# EAGLE schematic ChargerShieldExp (EAGLE 6.5.0)
Dings

## Sheet 1 of 2: User Interface
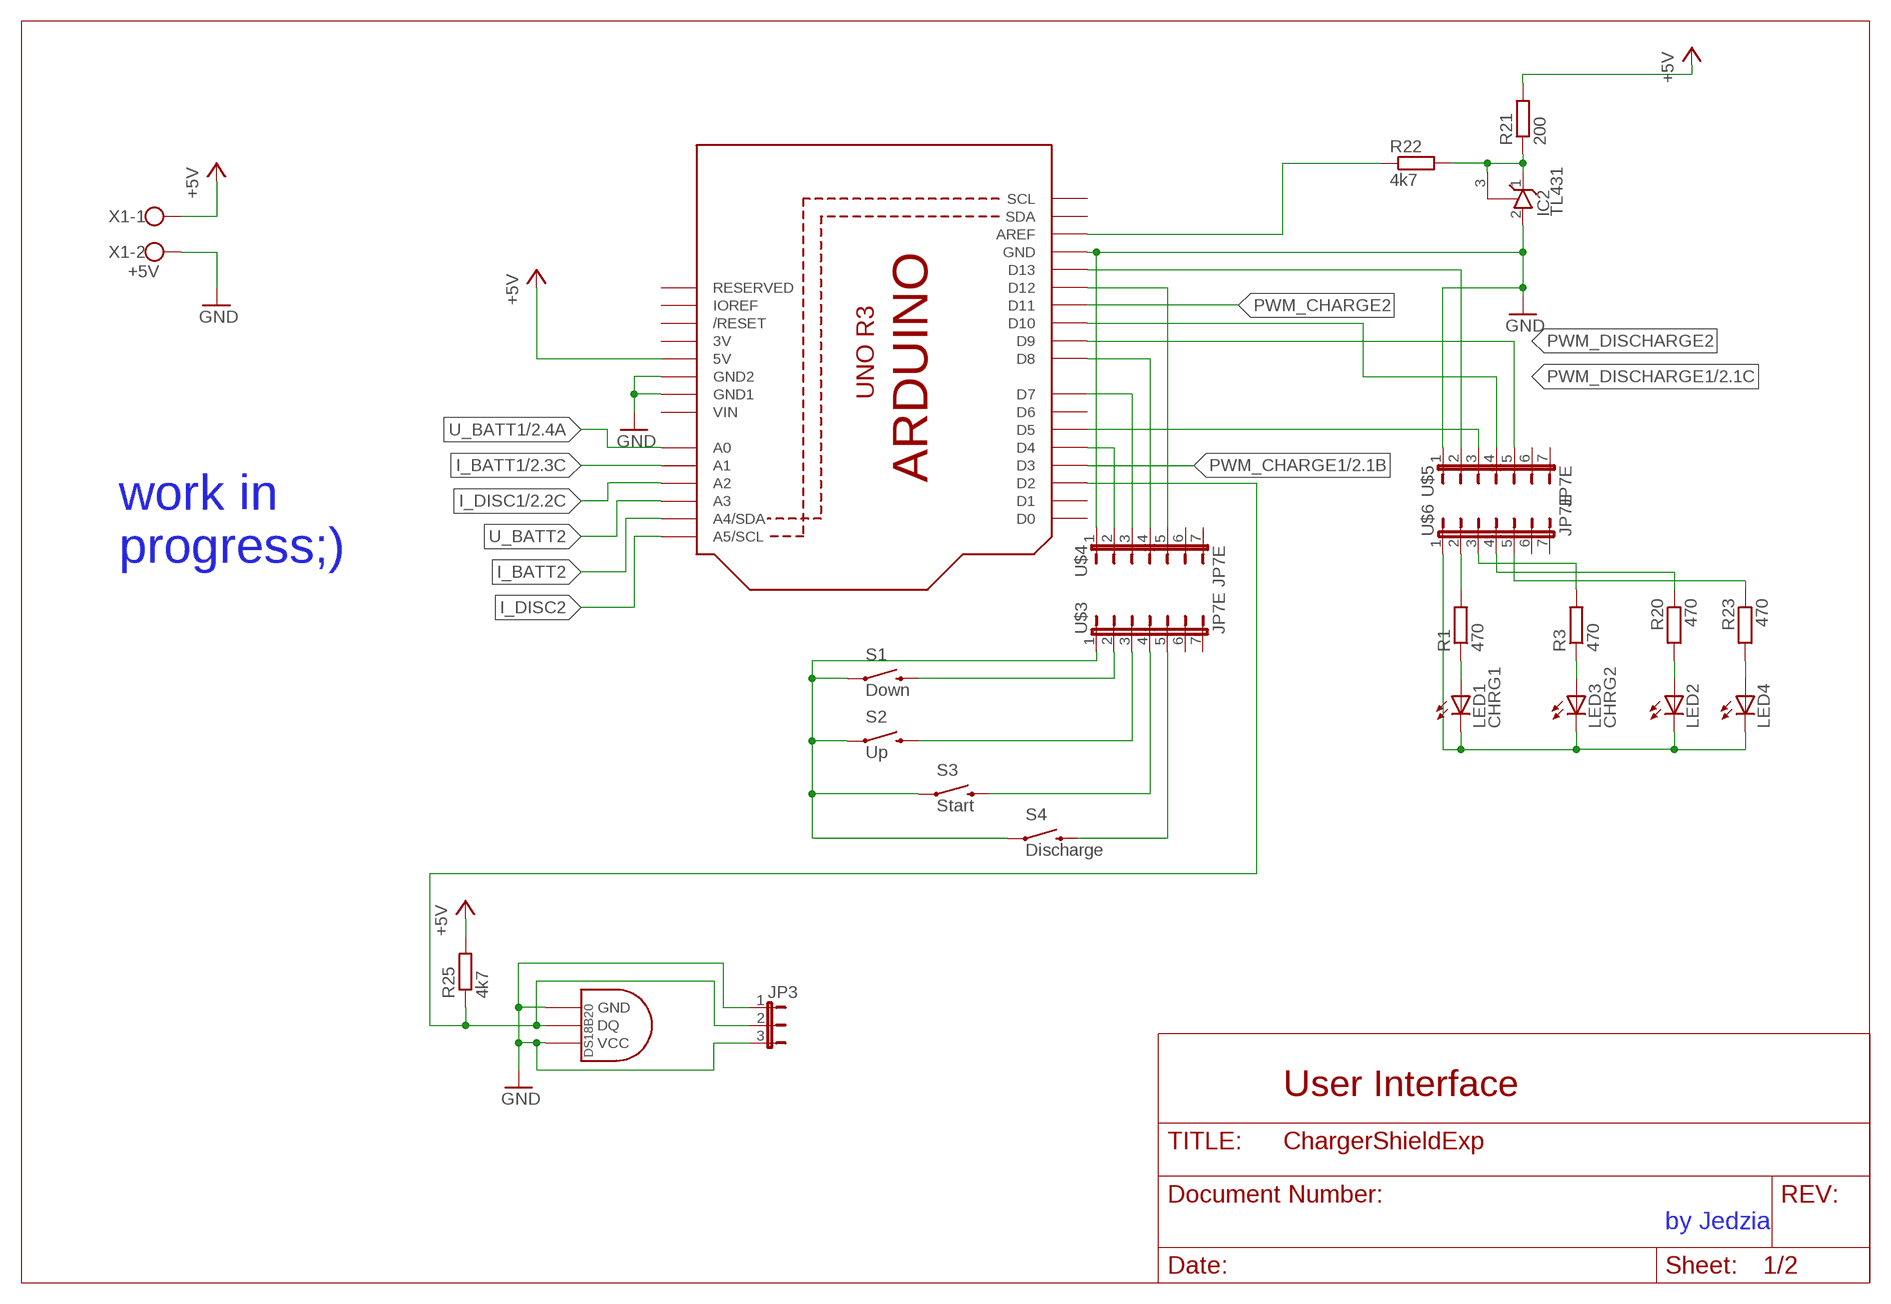
[diagram p0: schematic, sheet 1]

### Parts
IC2  TL431  TL431TO92  [TO92]
JP3  JP2E  [JP2]
LED1  CHRG1  LED5MM_BIG  [LED5MM_BIG]
LED2  LED5MM_BIG  [LED5MM_BIG]
LED3  CHRG2  LED5MM_BIG  [LED5MM_BIG]
LED4  LED5MM_BIG  [LED5MM_BIG]
R1  470  R-EU_0207/12  [0207/12]
R3  470  R-EU_0207/10  [0207/10]
R20  470  R-EU_0207/10  [0207/10]
R21  200  R-EU_0204/7  [0204/7]
R22  4k7  R-EU_0207/10  [0207/10]
R23  470  R-EU_0207/10  [0207/10]
R25  4k7  R-EU_0204/7  [0204/7]
S1  Down  SWITCH-MOMENTARY-2PTH  [TACTILE-PTH]
S2  Up  SWITCH-MOMENTARY-2PTH  [TACTILE-PTH]
S3  Start  SWITCH-MOMENTARY-2PTH  [TACTILE-PTH]
S4  Discharge  SWITCH-MOMENTARY-2PTH  [TACTILE-PTH]
U$1  ARDUINOR3BPLACE-LONG  [ARDUINOR3-BPLACE-LONG]
U$2  DS1820TO92  [DS1820]
U$3  JP7E  [JP7]
U$4  JP7E  [JP7]
U$5  JP7E  [JP7]
U$6  JP7E  [JP7]
X1  +5V  W237-102  [W237-102]

### Nets
+5V: R21.2 R25.2 U$1.5V X1.1 ; also sheet 2
GND: IC2.2(A) JP3.1 JP3.3 U$1.GND U$1.GND1 U$1.GND2 U$2.GND U$2.VDD(VCC) U$4.1 U$5.1 X1.2 ; also sheet 2
GND2: LED1.K(C) LED2.K(C) LED3.K(C) LED4.K(C) S1.1 S2.1 S3.1 S4.1 U$3.1 U$6.1
I_BATT1: U$1.A1 ; also sheet 2
I_BATT2: U$1.A4(A4/SDA)
I_DISC1: U$1.A2 ; also sheet 2
I_DISC2: U$1.A5(A5/SCL)
N$1: U$1.D13 U$5.2
N$2: LED1.A R1.1
N$3: S1.3 U$3.2
N$4: S2.3 U$3.3
N$12: JP3.2 R25.1 U$1.D2 U$2.DQ
N$19: U$1.D5 U$5.3
N$20: LED2.A R20.2
N$21: LED4.A R23.2
N$22: S3.3 U$3.4
N$23: U$1.D12 U$4.5
N$24: LED3.A R3.1
N$26: U$1.D4 U$4.2
N$27: IC2.1(C) IC2.3(R) R21.1 R22.2
N$28: R22.1 U$1.AREF
N$30: U$1.D7 U$4.3
N$31: U$1.D8 U$4.4
N$32: S4.3 U$3.5
N$33: R3.2 U$6.3
N$34: R1.2 U$6.2
N$35: R20.1 U$6.4
N$36: R23.1 U$6.5
PWM_CHARGE1: U$1.D3 ; also sheet 2
PWM_CHARGE2: U$1.D11
PWM_DISCHARGE1: U$1.D10 U$5.4 ; also sheet 2
PWM_DISCHARGE2: U$1.D9 U$5.5
U_BATT1: U$1.A0 ; also sheet 2
U_BATT2: U$1.A3
Unconnected: U$1.D0 U$1.D1 U$1.D6 U$1.IOREF U$1.RESERVED U$1.RESET(/RESET) U$1.SCL U$1.SDA U$3.6 U$3.7 U$4.6 U$4.7 U$5.6 U$5.7 U$6.6 U$6.7

### Notes on the sheet
- work in
  progress;)
- User Interface
- by Jedzia

## Sheet 2 of 2
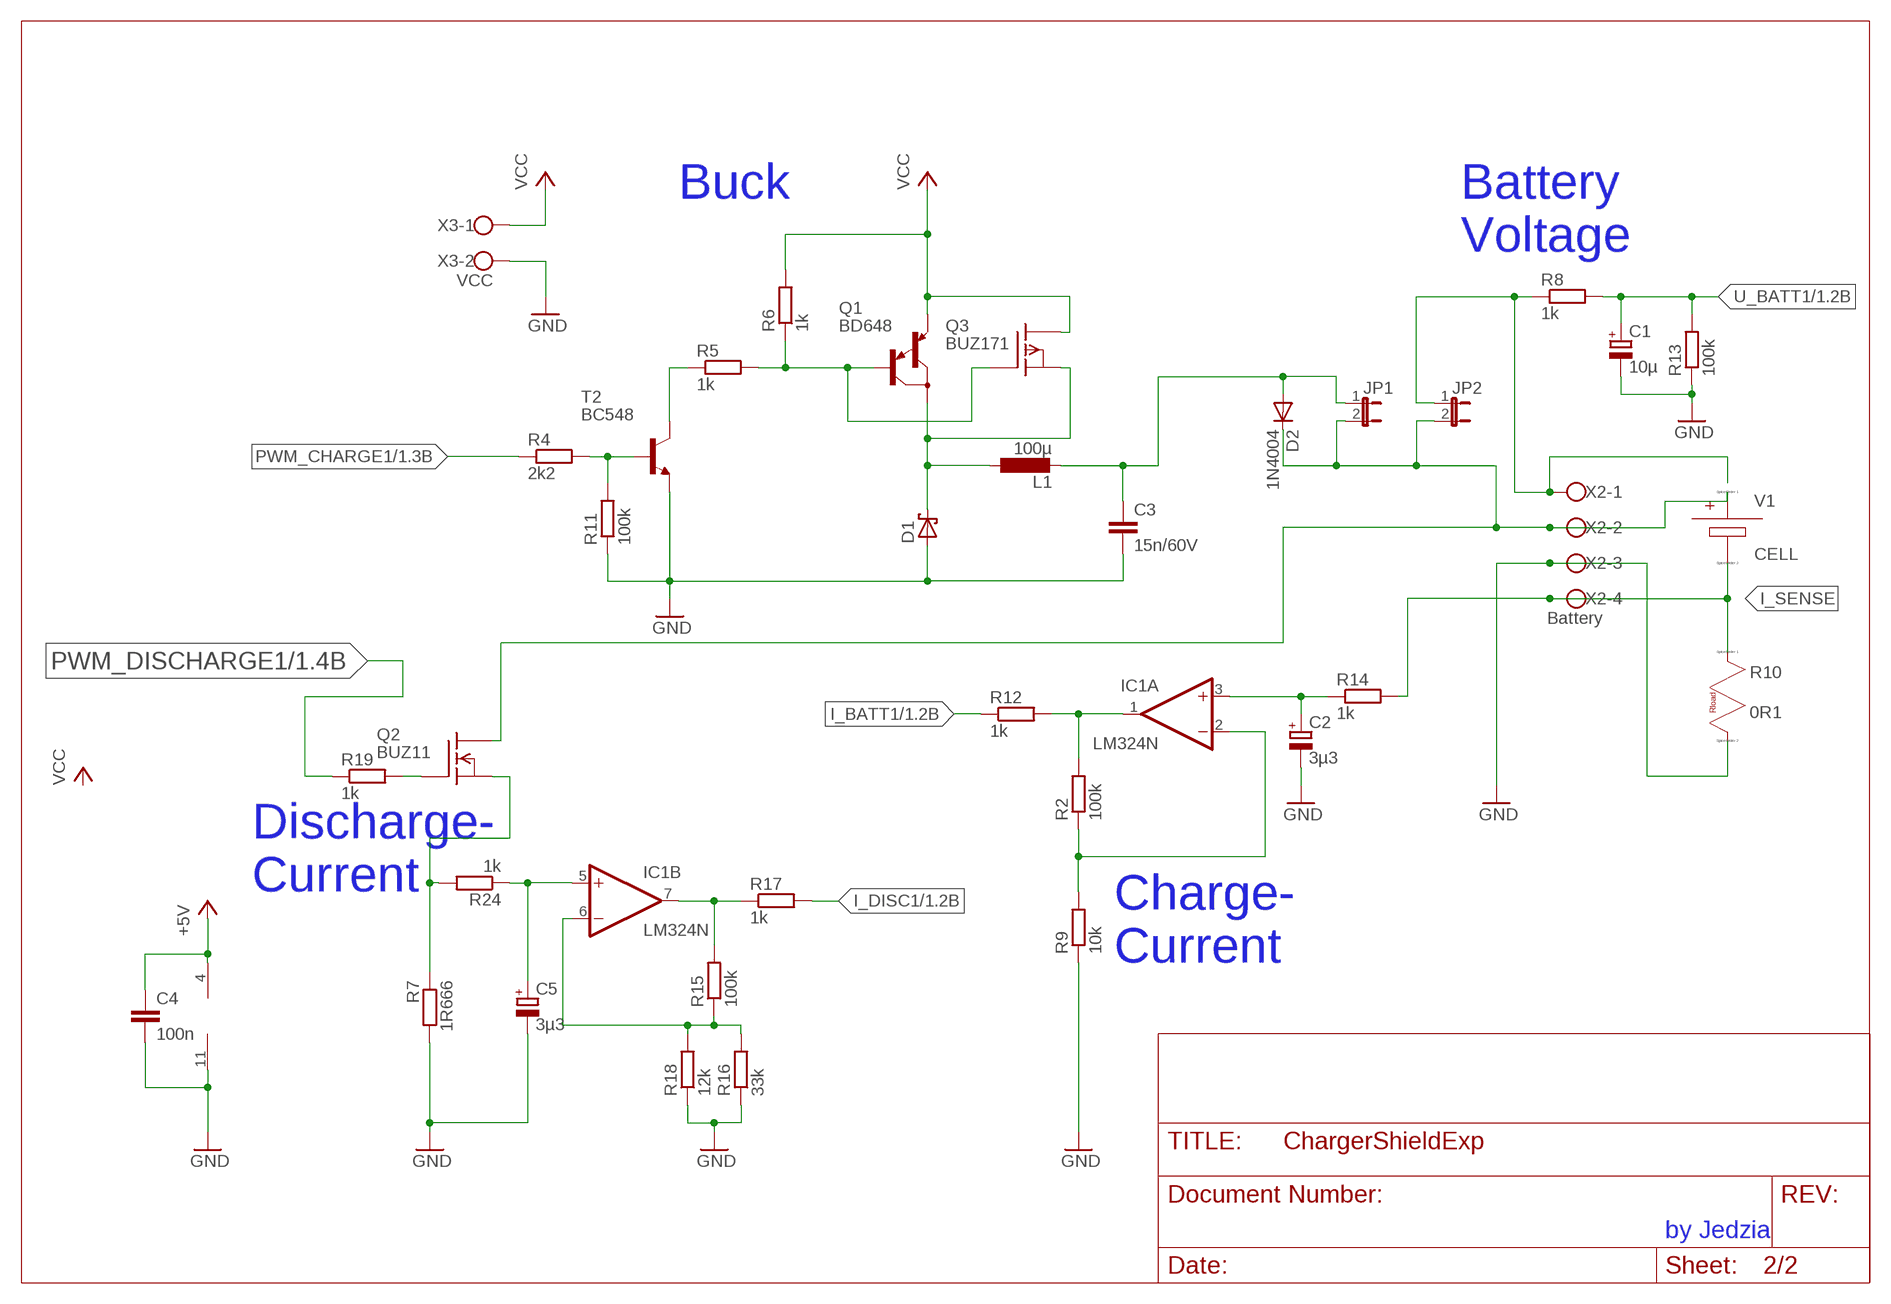
[diagram p1: schematic, sheet 2]

### Parts
C1  10µ  CPOL-EUE5-5  [E5-5]
C2  3µ3  CPOL-EUE5-5  [E5-5]
C3  15n/60V  C-EU025_050-025X075  [C025_050-025X075]
C4  100n  C-EU025_050-025X075  [C025_050-025X075]
C5  3µ3  CPOL-EUE5-5  [E5-5]
D1  SCHOTTKY-DIODEDO35-7  [DO35-7]
D2  1N4004  [DO41-10]
IC1  LM324N  [DIL14]
JP1  JP1E  [JP1]
JP2  JP1E  [JP1]
L1  100µ  L-EU0207/12  [0207/12]
Q1  BD648  [TO220]
Q2  BUZ11  [TO220]
Q3  BUZ171  [TO220]
R2  100k  R-EU_0204/7  [0204/7]
R4  2k2  R-EU_0207/10  [0207/10]
R5  1k  R-EU_0207/10  [0207/10]
R6  1k  R-EU_0207/10  [0207/10]
R7  1R666  R-EU_0414/15  [0414/15]
R8  1k  R-EU_0207/12  [0207/12]
R9  10k  R-EU_0204/7  [0204/7]
R10  0R1  RES_RLOAD  (no package)
R11  100k  R-EU_0207/10  [0207/10]
R12  1k  R-EU_0207/12  [0207/12]
R13  100k  R-EU_0207/10  [0207/10]
R14  1k  R-EU_0207/10  [0207/10]
R15  100k  R-EU_0207/10  [0207/10]
R16  33k  R-EU_0207/10  [0207/10]
R17  1k  R-EU_0207/15  [0207/15]
R18  12k  R-EU_0207/10  [0207/10]
R19  1k  R-EU_0207/12  [0207/12]
R24  1k  R-EU_0207/10  [0207/10]
T2  BC548  BC238  [TO92]
V1  CELL  (no package)
X2  Battery  W237-4  [W237-4]
X3  VCC  W237-102  [W237-102]

### Nets
+5V: C4.1 IC1.4(P:V+) ; also sheet 1
GND: C1.- C2.- C3.2 C4.2 C5.- D1.A IC1.11(P:V-) R7.2 R9.1 R10.B R11.1 R13.1 R16.1 R18.1 T2.1(E) X2.3 X3.2 ; also sheet 1
I_BATT1: R12.1 ; also sheet 1
I_DISC1: R17.2 ; also sheet 1
I_SENSE: R10.A R14.2 V1.- X2.4
N$5: R4.2 R11.2 T2.2(B)
N$6: R5.1 T2.3(C)
N$7: Q1.1(B) Q3.1(G) R5.2 R6.1
N$8: JP2.1 R8.1 X2.1
N$9: D1.C L1.1 Q1.2(C) Q3.3(S)
N$10: C3.1 D2.A JP1.1 L1.2
N$11: IC1.1(A:OUT) R2.2 R12.2
N$13: D2.C JP1.2 JP2.2 Q2.2(D) V1.+ X2.2
N$14: IC1.2(A:-IN) R2.1 R9.2
N$15: C2.+ IC1.3(A:+IN) R14.1
N$16: IC1.6(B:-IN) R15.1 R16.2 R18.2
N$17: IC1.7(B:OUT) R15.2 R17.1
N$18: Q2.1(G) R19.2
N$25: Q2.3(S) R7.1 R24.2
N$29: C5.+ IC1.5(B:+IN) R24.1
PWM_CHARGE1: R4.1 ; also sheet 1
PWM_DISCHARGE1: R19.1 ; also sheet 1
U_BATT1: C1.+ R8.2 R13.2 ; also sheet 1
VCC: Q1.3(E) Q3.2(D) R6.2 X3.1
Unconnected: IC1.8(C:OUT) IC1.9(C:-IN) IC1.10(C:+IN) IC1.12(D:+IN) IC1.13(D:-IN) IC1.14(D:OUT)

### Notes on the sheet
- Buck
- Battery
  Voltage
- Discharge-
  Current
- Charge-
  Current
- by Jedzia

## Power pins joined to a net without a drawn wire
3V: U$1.3V
VIN: U$1.VIN

## Library data of the parts
C1 C2 C5 = rcl:CPOL-EU: POLARIZED CAPACITOR, European symbol
C3 C4 = rcl:C-EU: CAPACITOR, European symbol
D1 = diode:SCHOTTKY-DIODE: Schottky Diode
D2 = diode:1N4004: DIODE general purpose rectifier, 1 A
IC1 = linear:LM324: OP AMP
IC2 = AWJLEagleLib:TL431: TL431 shunt regulator CARE: not a standard pinout. This part has 1: cathode, 2: REF, 3: anode
JP1 JP2 = bigger:JP1E: JUMPER
JP3 = bigger:JP2E: JUMPER
L1 = rcl:L-EU: INDUCTOR, European symbol
LED1-LED4 = bigger:LED: LED OSRAM: - CHIPLED LG R971, LG N971, LY N971, LG Q971, LY Q971, LO R971, LY R971 LH N974, LH R974 LS Q976, LO Q976, LY Q976 LO Q996 - Hyper CHIPLED LW Q18S LB Q993, LB Q99A, LB R99A - SideLED LS A670, LO A670, LY A670, LG A670, LP A670 LB A673, LV A673, LT A673, LW A673 LH A674 LY A675 LS A676, LA A676, LO A676, LY A676, LW A676 LS A679, LY A679, LG A679 - Hyper Micro SIDELED® LS Y876, LA Y876, LO Y876, LY Y876 LT Y87S - SmartLED LW L88C, LW L88S LB L89C, LB L89S, LG L890 LS L89K, LO L89K, LY L89K LS L896, LA L896, LO L896, LY L896 - TOPLED LS T670, LO T670, LY T670, LG T670, LP T670 LSG T670, LSP T670, LSY T670, LOP T670, LYG T670 LG T671, LOG T671, LSG T671 LB T673, LV T673, LT T673, LW T673 LH T674 LS T676, LA T676, LO T676, LY T676, LB T676, LH T676, LSB T676, LW T676 LB T67C, LV T67C, LT T67C, LS T67K, LO T67K, LY T67K, LW E67C LS E67B, LA E67B, LO E67B, LY E67B, LB E67C, LV E67C, LT E67C LW T67C LS T679, LY T679, LG T679 LS T770, LO T770, LY T770, LG T770, LP T770 LB T773, LV T773, LT T773, LW T773 LH T774 LS E675, LA E675, LY E675, LS T675 LS T776, LA T776, LO T776, LY T776, LB T776 LHGB T686 LT T68C, LB T68C - Hyper Mini TOPLED® LB M676 - Mini TOPLED Santana® LG M470 LS M47K, LO M47K, LY M47K Source: http://www.osram.convergy.de LUXEON: - LUMILED® LXK2-PW12-R00, LXK2-PW12-S00, LXK2-PW14-U00, LXK2-PW14-V00 LXK2-PM12-R00, LXK2-PM12-S00, LXK2-PM14-U00 LXK2-PE12-Q00, LXK2-PE12-R00, LXK2-PE12-S00, LXK2-PE14-T00, LXK2-PE14-U00 LXK2-PB12-K00, LXK2-PB12-L00, LXK2-PB12-M00, LXK2-PB14-N00, LXK2-PB14-P00, LXK2-PB14-Q00 LXK2-PR12-L00, LXK2-PR12-M00, LXK2-PR14-Q00, LXK2-PR14-R00 LXK2-PD12-Q00, LXK2-PD12-R00, LXK2-PD12-S00 LXK2-PH12-R00, LXK2-PH12-S00 LXK2-PL12-P00, LXK2-PL12-Q00, LXK2-PL12-R00 Source: www.luxeon.com KINGBRIGHT: KA-3528ASYC Source: www.kingbright.com
Q1 = transistor-pnp:BD648: PNP Darlington Transistor
Q2 = transistor-fet:BUZ11: N-Channel Enhancement MOSFET 50V; 30A; 0,040Ohm
Q3 = transistor-fet:BUZ171: P-Channel Enhancement MOSFET -50V; 7A; 0,4Ohm
R1-R9 R11-R25 = rcl:R-EU_: RESISTOR, European symbol
R10 = lt-spice-simulation:RES_RLOAD: A resistor
S1-S4 = SparkFun-Electromechanical:SWITCH-MOMENTARY-2: Various NO switches- pushbuttons, reed, etc
T2 = transistor:BC238: NPN TRANSISTOR
U$1 = arduino-long:ARDUINOR3: This is a new object for the new Arduino R3 - with extra pins that you may want to use (such as IOref, and duplicated A4/A5
U$2 = Ava:DS1820: DS18B20 Programmable Resolution 1-Wire Digital Thermometer Description The DS18B20 digital thermometer provides 9-bit to 12-bit Celsius temperature measurements and has an alarm function with nonvolatile user-programmable upper and lower trigger points. The DS18B20 communicates over a 1-Wire® bus that by definition requires only one data line (and ground) for communication with a central microprocessor. It has an operating temperature range of -55°C to +125°C and is accurate to ±0.5°C over the range of -10°C to +85°C. In addition, the DS18B20 can derive power directly from the data line ("parasite power"), eliminating the need for an external power supply. Each DS18B20 has a unique 64-bit serial code, which allows multiple DS18B20s to function on the same 1-Wire bus. Thus, it is simple to use one microprocessor to control many DS18B20s distributed over a large area. Applications that can benefit from this feature include HVAC environmental controls, temperature monitoring systems inside buildings, equipment, or machinery, and process monitoring and control systems.
U$3-U$6 = bigger:JP7E
V1 = Misc:CELL: Voltage Source, either DC, AC, PULSE, SINE, PWL, EXP, or SFFM
X1 X3 = con-wago-500:W237-102: WAGO SCREW CLAMP; MPN: 237-102; OC_FARNELL: unknown; OC_NEWARK: 70K9898
X2 = con-wago-500:W237-4: WAGO SCREW CLAMP; OC_FARNELL: unknown; OC_NEWARK: unknown